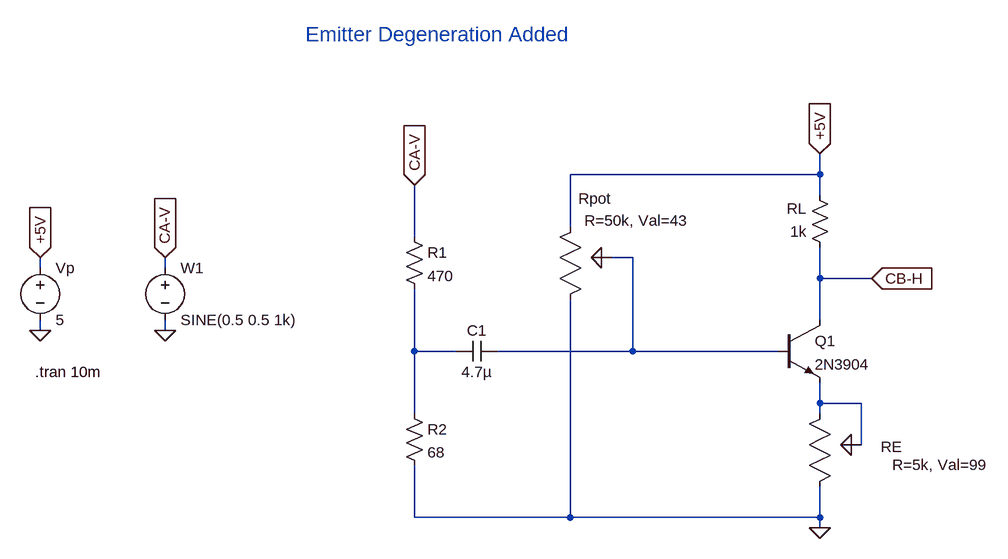
[diagram p0: schematic emitter_degeneration_added.asc]
emitter_degeneration_added.asc, the LTspice schematic file:
Version 4
SHEET 1 1572 820
WIRE 1312 256 1312 224
WIRE 1312 256 928 256
WIRE 1312 288 1312 256
WIRE 928 336 928 256
WIRE 688 352 688 272
WIRE 1024 384 992 384
WIRE 112 400 112 384
WIRE 304 400 304 384
WIRE 1312 416 1312 368
WIRE 1392 416 1312 416
WIRE 1312 480 1312 416
WIRE 112 496 112 480
WIRE 304 496 304 480
WIRE 688 528 688 432
WIRE 752 528 688 528
WIRE 1024 528 1024 384
WIRE 1024 528 816 528
WIRE 1248 528 1024 528
WIRE 1312 608 1312 576
WIRE 1376 608 1312 608
WIRE 688 624 688 528
WIRE 1312 624 1312 608
WIRE 1376 672 1376 608
WIRE 688 784 688 704
WIRE 928 784 928 448
WIRE 928 784 688 784
WIRE 1312 784 1312 736
WIRE 1312 784 928 784
WIRE 1312 800 1312 784
FLAG 1312 800 0
FLAG 1392 416 CB-H
IOPIN 1392 416 In
FLAG 112 496 0
FLAG 304 496 0
FLAG 112 384 +5V
IOPIN 112 384 In
FLAG 304 384 CA-V
IOPIN 304 384 In
FLAG 1312 224 +5V
IOPIN 1312 224 In
FLAG 688 272 CA-V
IOPIN 688 272 In
SYMBOL res 672 336 R0
SYMATTR InstName R1
SYMATTR Value 470
SYMBOL res 672 608 R0
SYMATTR InstName R2
SYMATTR Value 68
SYMBOL res 1328 384 R180
WINDOW 0 36 76 Left 2
WINDOW 3 36 40 Left 2
SYMATTR InstName RL
SYMATTR Value 1k
SYMBOL potentiometer 944 352 M0
WINDOW 0 -47 -59 Left 2
WINDOW 39 -165 -25 Left 2
SYMATTR InstName Rpot
SYMATTR SpiceLine R=50k, Val=43
SYMBOL npn 1248 480 R0
SYMATTR InstName Q1
SYMATTR Value 2N3904
SYMBOL cap 816 512 R90
WINDOW 0 0 32 VBottom 2
WINDOW 3 32 32 VTop 2
SYMATTR InstName C1
SYMATTR Value 4.7µ
SYMBOL voltage 304 384 R0
WINDOW 123 0 0 Left 0
WINDOW 39 0 0 Left 0
SYMATTR InstName W1
SYMATTR Value SINE(0.5 0.5 1k)
SYMBOL voltage 112 384 R0
WINDOW 123 0 0 Left 0
WINDOW 39 0 0 Left 0
SYMATTR InstName Vp
SYMATTR Value 5
SYMBOL potentiometer 1328 640 M0
WINDOW 0 -111 35 Left 2
WINDOW 39 -242 63 Left 2
SYMATTR InstName RE
SYMATTR SpiceLine R=5k, Val=99
TEXT 520 40 Left 3 ;Emitter Degeneration Added
TEXT 104 560 Left 2 !.tran 10m

The netlist it stands for:
* emitter_degeneration_added.asc
R1 CA-V N002 470
R2 N002 0 68
RL CB-H +5V 1k
XRpot +5V N001 0 potentiometer R=50k, Val=43  ; pins 1 2 3
Q1 CB-H N001 N003 0 2N3904
C1 N001 N002 4.7µ
V§W1 CA-V 0 SINE(0.5 0.5 1k)
Vp +5V 0 5
XRE N003 N003 0 potentiometer R=5k, Val=99  ; pins 1 2 3
.model NPN NPN
.model PNP PNP
.lib standard.bjt
* Emitter Degeneration Added
.tran 10m
.backanno
.end